# Altium schematic sheet clock.SchDoc: Clock
size 431 x 241 mm; CheckedBy: J. Brinton; CompanyName: Signal Laboratories, Inc.; DrawnBy: J. Brinton; Engineer: J. Brinton; Address1: 3479 Edison Way; Address2: Menlo Park CA 94025; Address3: +1 (877) 778-8435; Address4: siglabs.com; Revision: 3; SheetNumber: 32; SheetTotal: 49
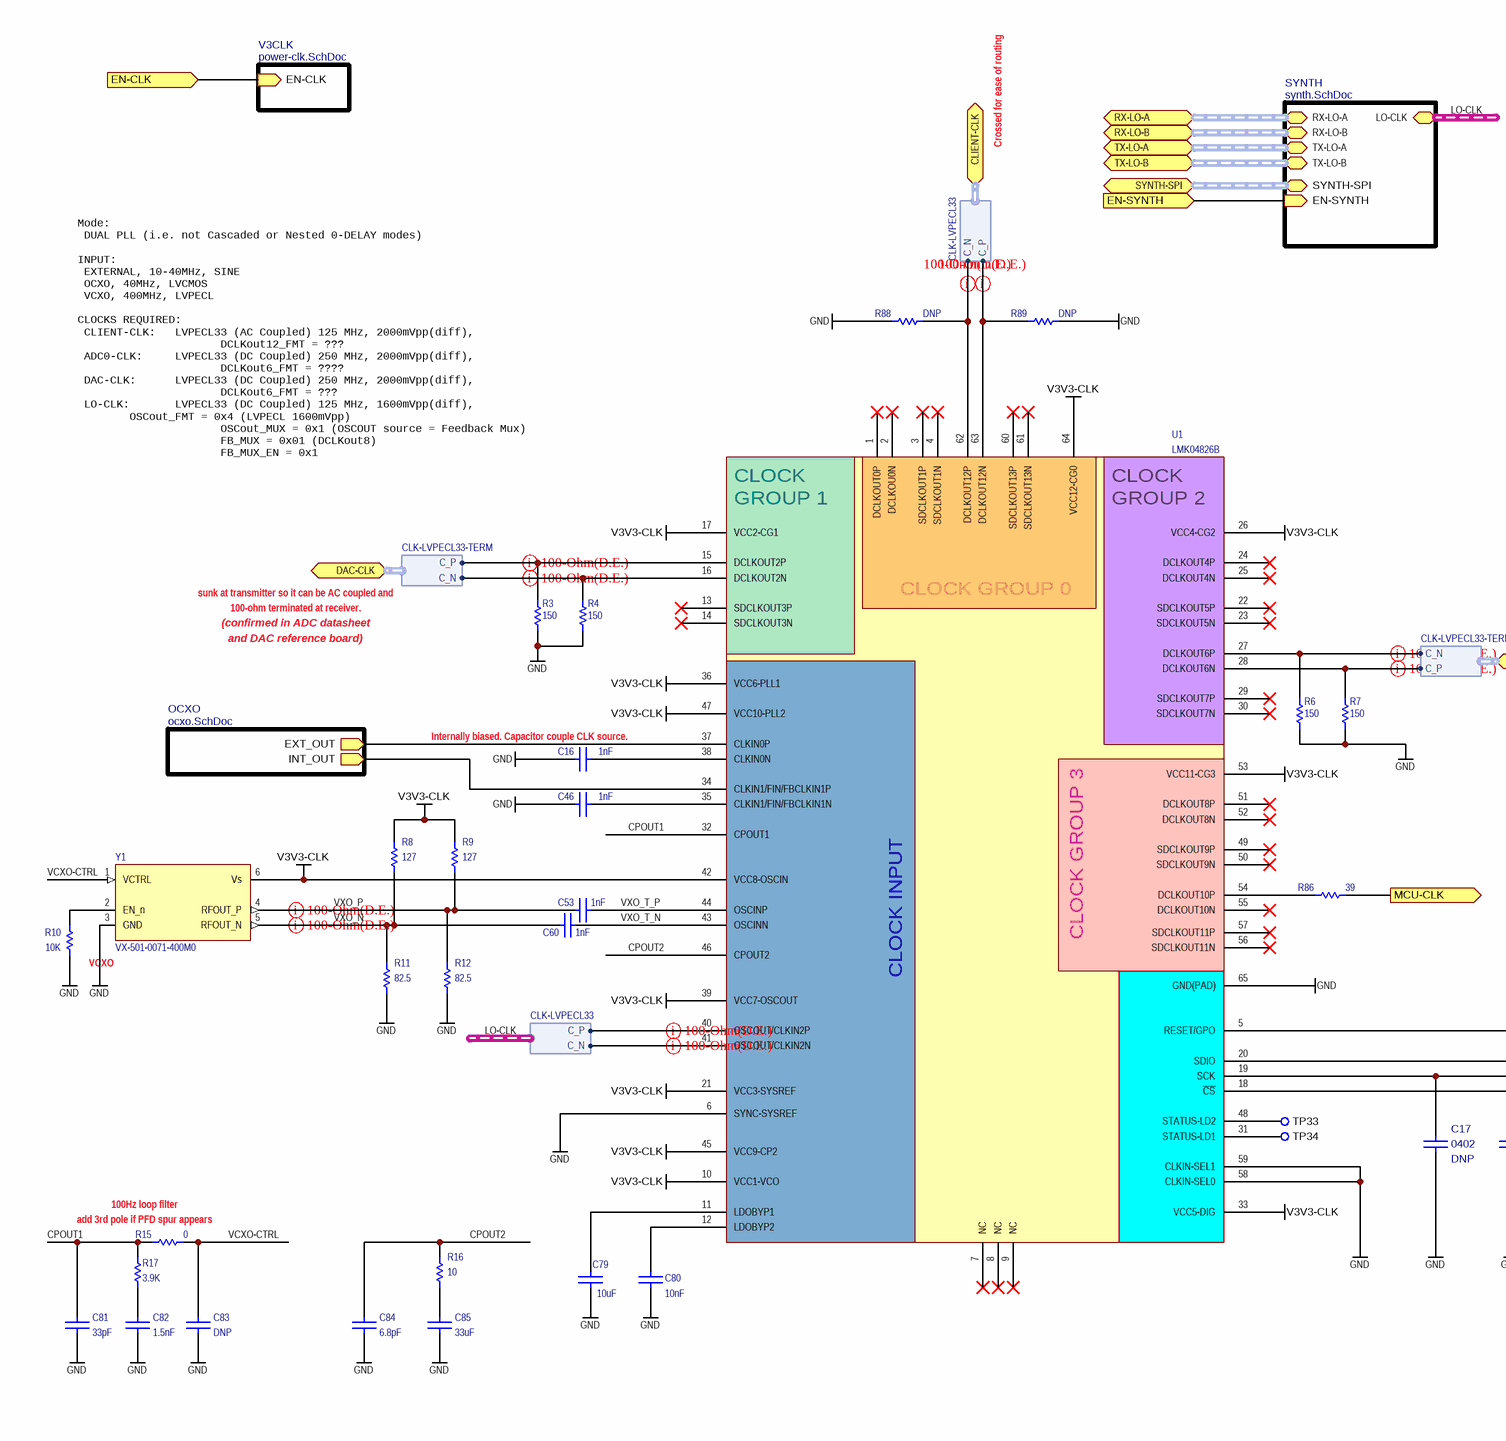
[diagram p0: clock.SchDoc, left]
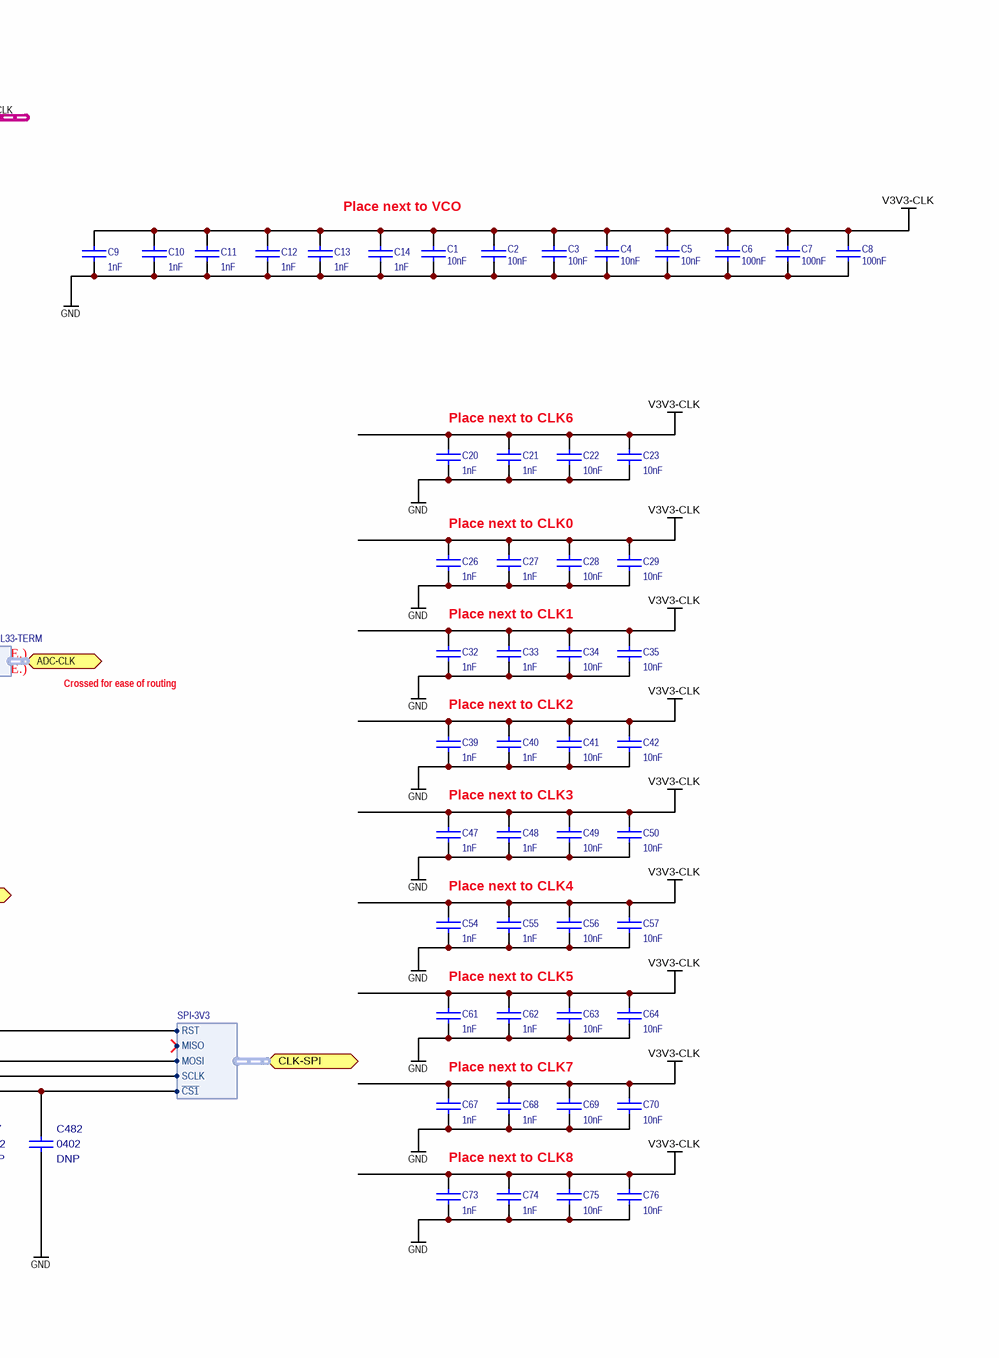
[diagram p1: clock.SchDoc, right]

## Parts
C1  value 10nF  [CAPC100X50X55L25N]  (hidden comment: GRM155R71H103KA88)
C2  value 10nF  [CAPC100X50X55L25N]  (hidden comment: GRM155R71H103KA88)
C3  value 10nF  [CAPC100X50X55L25N]  (hidden comment: GRM155R71H103KA88)
C4  value 10nF  [CAPC100X50X55L25N]  (hidden comment: GRM155R71H103KA88)
C5  value 10nF  [CAPC100X50X55L25N]  (hidden comment: GRM155R71H103KA88)
C6  value 100nF  [CAPC100X50X55L25N]  (hidden comment: GRM155R71C104KA88J)
C7  value 100nF  [CAPC100X50X55L25N]  (hidden comment: GRM155R71C104KA88J)
C8  value 100nF  [CAPC100X50X55L25N]  (hidden comment: GRM155R71C104KA88J)
C9  value 1nF  [CAPC100X50X55L25N]  (hidden comment: CGA2B2NP01H102J050BA)
C10  value 1nF  [CAPC100X50X55L25N]  (hidden comment: CGA2B2NP01H102J050BA)
C11  value 1nF  [CAPC100X50X55L25N]  (hidden comment: CGA2B2NP01H102J050BA)
C12  value 1nF  [CAPC100X50X55L25N]  (hidden comment: CGA2B2NP01H102J050BA)
C13  value 1nF  [CAPC100X50X55L25N]  (hidden comment: CGA2B2NP01H102J050BA)
C14  value 1nF  [CAPC100X50X55L25N]  (hidden comment: CGA2B2NP01H102J050BA)
C16  value 1nF  [CAPC100X50X55L25N]  (hidden comment: CGA2B2NP01H102J050BA)
C17  Package: 0402  Do Not Place: DNP  [CAPC100X50X55L25N]  (hidden comment: VJ0402A101KXA)
C20  value 1nF  [CAPC100X50X55L25N]  (hidden comment: CGA2B2NP01H102J050BA)
C21  value 1nF  [CAPC100X50X55L25N]  (hidden comment: CGA2B2NP01H102J050BA)
C22  value 10nF  [CAPC100X50X55L25N]  (hidden comment: GRM155R71H103KA88)
C23  value 10nF  [CAPC100X50X55L25N]  (hidden comment: GRM155R71H103KA88)
C26  value 1nF  [CAPC100X50X55L25N]  (hidden comment: CGA2B2NP01H102J050BA)
C27  value 1nF  [CAPC100X50X55L25N]  (hidden comment: CGA2B2NP01H102J050BA)
C28  value 10nF  [CAPC100X50X55L25N]  (hidden comment: GRM155R71H103KA88)
C29  value 10nF  [CAPC100X50X55L25N]  (hidden comment: GRM155R71H103KA88)
C32  value 1nF  [CAPC100X50X55L25N]  (hidden comment: CGA2B2NP01H102J050BA)
C33  value 1nF  [CAPC100X50X55L25N]  (hidden comment: CGA2B2NP01H102J050BA)
C34  value 10nF  [CAPC100X50X55L25N]  (hidden comment: GRM155R71H103KA88)
C35  value 10nF  [CAPC100X50X55L25N]  (hidden comment: GRM155R71H103KA88)
C39  value 1nF  [CAPC100X50X55L25N]  (hidden comment: CGA2B2NP01H102J050BA)
C40  value 1nF  [CAPC100X50X55L25N]  (hidden comment: CGA2B2NP01H102J050BA)
C41  value 10nF  [CAPC100X50X55L25N]  (hidden comment: GRM155R71H103KA88)
C42  value 10nF  [CAPC100X50X55L25N]  (hidden comment: GRM155R71H103KA88)
C46  value 1nF  [CAPC100X50X55L25N]  (hidden comment: CGA2B2NP01H102J050BA)
C47  value 1nF  [CAPC100X50X55L25N]  (hidden comment: CGA2B2NP01H102J050BA)
C48  value 1nF  [CAPC100X50X55L25N]  (hidden comment: CGA2B2NP01H102J050BA)
C49  value 10nF  [CAPC100X50X55L25N]  (hidden comment: GRM155R71H103KA88)
C50  value 10nF  [CAPC100X50X55L25N]  (hidden comment: GRM155R71H103KA88)
C53  value 1nF  [CAPC100X50X55L25N]  (hidden comment: CGA2B2NP01H102J050BA)
C54  value 1nF  [CAPC100X50X55L25N]  (hidden comment: CGA2B2NP01H102J050BA)
C55  value 1nF  [CAPC100X50X55L25N]  (hidden comment: CGA2B2NP01H102J050BA)
C56  value 10nF  [CAPC100X50X55L25N]  (hidden comment: GRM155R71H103KA88)
C57  value 10nF  [CAPC100X50X55L25N]  (hidden comment: GRM155R71H103KA88)
C60  value 1nF  [CAPC100X50X55L25N]  (hidden comment: CGA2B2NP01H102J050BA)
C61  value 1nF  [CAPC100X50X55L25N]  (hidden comment: CGA2B2NP01H102J050BA)
C62  value 1nF  [CAPC100X50X55L25N]  (hidden comment: CGA2B2NP01H102J050BA)
C63  value 10nF  [CAPC100X50X55L25N]  (hidden comment: GRM155R71H103KA88)
C64  value 10nF  [CAPC100X50X55L25N]  (hidden comment: GRM155R71H103KA88)
C67  value 1nF  [CAPC100X50X55L25N]  (hidden comment: CGA2B2NP01H102J050BA)
C68  value 1nF  [CAPC100X50X55L25N]  (hidden comment: CGA2B2NP01H102J050BA)
C69  value 10nF  [CAPC100X50X55L25N]  (hidden comment: GRM155R71H103KA88)
C70  value 10nF  [CAPC100X50X55L25N]  (hidden comment: GRM155R71H103KA88)
C73  value 1nF  [CAPC100X50X55L25N]  (hidden comment: CGA2B2NP01H102J050BA)
C74  value 1nF  [CAPC100X50X55L25N]  (hidden comment: CGA2B2NP01H102J050BA)
C75  value 10nF  [CAPC100X50X55L25N]  (hidden comment: GRM155R71H103KA88)
C76  value 10nF  [CAPC100X50X55L25N]  (hidden comment: GRM155R71H103KA88)
C79  value 10uF  [CAPC160X80X90L20N]  (hidden comment: ZRB18AR61E106ME01L)
C80  value 10nF  [CAPC100X50X55L25N]  (hidden comment: GRM155R71H103KA88)
C81  value 33pF  [CAPC100X50X55L25N]  (hidden comment: GRM1555C1H330JA01D)
C82  value 1.5nF  [CAPC100X50X55L25N]  (hidden comment: EMK105SD152KV-F)
C83  Do Not Place: DNP  [CAPC100X50X55L25N]  (hidden comment: CGA2B2NP01H102J050BA)
C84  value 6.8pF  [CAPC160X80X90L20N]  (hidden comment: 06032U6R8BAT2A)
C85  value 33uF  [CAPC2012X145N]  (hidden comment: C2012X5R1A336M125AC)
C482  Package: 0402  Do Not Place: DNP  [CAPC100X50X55L25N]  (hidden comment: VJ0402A101KXA)
R3  value 150  [RESC1005X40N]  (hidden comment: ERJ-2RKF1500X)
R4  value 150  [RESC1005X40N]  (hidden comment: ERJ-2RKF1500X)
R6  value 150  [RESC1005X40N]  (hidden comment: ERJ-2RKF1500X)
R7  value 150  [RESC1005X40N]  (hidden comment: ERJ-2RKF1500X)
R8  value 127  [RESC1005X40N]  (hidden comment: ERA-2AEB1270X)
R9  value 127  [RESC1005X40N]  (hidden comment: ERA-2AEB1270X)
R10  value 10K  [RESC1005X40N]  (hidden comment: ERJ-2RKF1002X)
R11  value 82.5  [RESC1005X40N]  (hidden comment: ERA-2AEB82R5X)
R12  value 82.5  [RESC1005X40N]  (hidden comment: ERA-2AEB82R5X)
R15  value 0  [RESC1005X40N]  (hidden comment: ERJ-2GE0R00X)
R16  value 10  [RESC1005X40N]  (hidden comment: MCS04020C1009FE000)
R17  value 3.9K  [RESC1608X55N]  (hidden comment: ERA-3AEB392V)
R86  value 39  [RESC1005X40N]  (hidden comment: RC0402FR-0739RL)
R88  Do Not Place: DNP  [RESC1005X40N]  (hidden comment: ERJ-2RKF1500X)
R89  Do Not Place: DNP  [RESC1005X40N]  (hidden comment: ERJ-2RKF1500X)
TP33  TEST_POINT_SMD_50  [TEST_POINT_SMD_10]  (value not drawn)  (no BOM)
TP34  TEST_POINT_SMD_50  [TEST_POINT_SMD_10]  (value not drawn)  (no BOM)
U1  LMK04826B  [NKD0064A]
Y1  VX-501-0071-400M0  [G218]

## Sub-sheets
OCXO = ocxo.SchDoc: EXT_OUT (out), INT_OUT (out)
SYNTH = synth.SchDoc: LO-CLK (harness CLK-LVPECL33), RX-LO-A (harness CLK-LVPECL33-TERM), RX-LO-B (harness CLK-LVPECL33-TERM), SYNTH-SPI (harness SPI-3V3), TX-LO-A (harness CLK-LVDS), TX-LO-B (harness CLK-LVDS), EN-SYNTH (in)
V3CLK = power-clk.SchDoc: EN-CLK (in)

## Ports
ADC-CLK (harness CLK-LVPECL33-TERM), CLIENT-CLK (harness CLK-LVPECL33), CLK-SPI (harness SPI-3V3), DAC-CLK (harness CLK-LVPECL33-TERM), EN-CLK (in), EN-SYNTH (in), MCU-CLK (out), RX-LO-A (harness CLK-LVPECL33-TERM), RX-LO-B (harness CLK-LVPECL33-TERM), SYNTH-SPI (harness SPI-3V3), TX-LO-A (harness CLK-LVDS), TX-LO-B (harness CLK-LVDS)

## Harnesses
CLK-LVPECL33: C_P, C_N
CLK-LVPECL33-TERM: C_P, C_N
SPI-3V3: MOSI, MISO, SCLK, ~{CS1}, RST

## Nets
GND: C1.1 C2.1 C3.1 C4.1 C5.1 C6.1 C7.1 C8.1 C9.1 C10.1 C11.1 C12.1 C13.1 C14.1 C16.2 C17.2 C20.1 C21.1 C22.1 C23.1 C26.1 C27.1 C28.1 C29.1 C32.1 C33.1 C34.1 C35.1 C39.1 C40.1 C41.1 C42.1 C46.2 C47.1 C48.1 C49.1 C50.1 C54.1 C55.1 C56.1 C57.1 C61.1 C62.1 C63.1 C64.1 C67.1 C68.1 C69.1 C70.1 C73.1 C74.1 C75.1 C76.1 C79.1 C80.1 C81.2 C82.2 C83.2 C84.2 C85.2 C482.2 R3.2 R4.2 R6.1 R7.1 R10.2 R11.1 R12.1 R88.2 R89.1 U1.6(SYNC-SYSREF) U1.58(CLKIN-SEL0) U1.59(CLKIN-SEL1) U1.65(GND(PAD)) Y1.3(GND)
V3V3-CLK: C1.2 C2.2 C3.2 C4.2 C5.2 C6.2 C7.2 C8.2 C9.2 C10.2 C11.2 C12.2 C13.2 C14.2 C20.2 C21.2 C22.2 C23.2 C26.2 C27.2 C28.2 C29.2 C32.2 C33.2 C34.2 C35.2 C39.2 C40.2 C41.2 C42.2 C47.2 C48.2 C49.2 C50.2 C54.2 C55.2 C56.2 C57.2 C61.2 C62.2 C63.2 C64.2 C67.2 C68.2 C69.2 C70.2 C73.2 C74.2 C75.2 C76.2 R8.2 R9.2 U1.10(VCC1-VCO) U1.17(VCC2-CG1) U1.21(VCC3-SYSREF) U1.26(VCC4-CG2) U1.33(VCC5-DIG) U1.36(VCC6-PLL1) U1.39(VCC7-OSCOUT) U1.42(VCC8-OSCIN) U1.45(VCC9-CP2) U1.47(VCC10-PLL2) U1.53(VCC11-CG3) U1.64(VCC12-CG0) Y1.6(Vs)
CPOUT1: C81.1 R15.1 R17.2 U1.32(CPOUT1)
CPOUT2: C84.1 R16.2 U1.46(CPOUT2)
EN-CLK: port EN-CLK, sheet V3CLK/EN-CLK
EN-SYNTH: port EN-SYNTH, sheet SYNTH/EN-SYNTH
LO-CLK.C_N: U1.41(OSCOUT/CLKIN2N) ; sheet SYNTH/LO-CLK.C_N
LO-CLK.C_P: U1.40(OSCOUT/CLKIN2P) ; sheet SYNTH/LO-CLK.C_P
MCU-CLK: R86.2 ; port MCU-CLK
VCXO-CTRL: C83.1 R15.2 Y1.1(VCTRL)
VXO_N: C60.1 R8.1 R11.2 Y1.5(RFOUT_N)
VXO_P: C53.2 R9.1 R12.2 Y1.4(RFOUT_P)
VXO_T_N: C60.2 U1.43(OSCINN)
VXO_T_P: C53.1 U1.44(OSCINP)
NetC16_1: C16.1 U1.38(CLKIN0N)
NetC17_1: C17.1 U1.19(SCK) ; port CLK-SPI.SCLK
NetC46_1: C46.1 U1.35(CLKIN1/FIN/FBCLKIN1N)
NetC79_2: C79.2 U1.11(LDOBYP1)
NetC80_2: C80.2 U1.12(LDOBYP2)
NetC82_1: C82.1 R17.1
NetC85_1: C85.1 R16.1
NetC482_1: C482.1 U1.18(~{CS}) ; port CLK-SPI.~{CS1}
NetR3_1: R3.1 U1.15(DCLKOUT2P) ; port DAC-CLK.C_P
NetR4_1: R4.1 U1.16(DCLKOUT2N) ; port DAC-CLK.C_N
NetR6_2: R6.2 U1.27(DCLKOUT6P) ; port ADC-CLK.C_N
NetR7_2: R7.2 U1.28(DCLKOUT6N) ; port ADC-CLK.C_P
NetR10_1: R10.1 Y1.2(EN_n)
NetR86_1: R86.1 U1.54(DCLKOUT10P)
NetR88_1: R88.1 U1.62(DCLKOUT12P) ; port CLIENT-CLK.C_N
NetR89_2: R89.2 U1.63(DCLKOUT12N) ; port CLIENT-CLK.C_P
NetTP33_1: TP33.1 U1.48(STATUS-LD2)
NetTP34_1: TP34.1 U1.31(STATUS-LD1)
NetU1_5: U1.5(RESET/GPO) ; port CLK-SPI.RST
NetU1_20: U1.20(SDIO) ; port CLK-SPI.MOSI
NetU1_34: U1.34(CLKIN1/FIN/FBCLKIN1P) ; sheet OCXO/INT_OUT
NetU1_37: U1.37(CLKIN0P) ; sheet OCXO/EXT_OUT

Not connected (* = marked no-connect by the designer): U1 1(DCLKOUT0P)* 2(DCLKOU0N)* 3(SDCLKOUT1P)* 4(SDCLKOUT1N)* 7(NC)* 8(NC)* 9(NC)* 13(SDCLKOUT3P)* 14(SDCLKOUT3N)* 22(SDCLKOUT5P)* 23(SDCLKOUT5N)* 24(DCLKOUT4P)* 25(DCLKOUT4N)* 29(SDCLKOUT7P)* 30(SDCLKOUT7N)* 49(SDCLKOUT9P)* 50(SDCLKOUT9N)* 51(DCLKOUT8P)* 52(DCLKOUT8N)* 55(DCLKOUT10N)* 56(SDCLKOUT11N)* 57(SDCLKOUT11P)* 60(SDCLKOUT13P)* 61(SDCLKOUT13N)*

## Buses and harness runs
harness LO-CLK = sheet SYNTH/LO-CLK
harness port RX-LO-A = sheet SYNTH/RX-LO-A
harness port RX-LO-B = sheet SYNTH/RX-LO-B
harness port SYNTH-SPI = sheet SYNTH/SYNTH-SPI
harness port TX-LO-A = sheet SYNTH/TX-LO-A
harness port TX-LO-B = sheet SYNTH/TX-LO-B

## Layout directives
differential pair; net class z100diff12; Name: 100-Ohm(D.E.): LO-CLK.C_N, LO-CLK.C_P, NetR3_1, NetR4_1, NetR6_2, NetR7_2, NetR88_1, NetR89_2, VXO_N, VXO_P

## Notes on the sheet
- (near R89) Crossed for ease of routing
- Place next to VCO
- Place next to CLK6
- Mode:
  DUAL PLL (i.e. not Cascaded or Nested 0-DELAY modes)
  INPUT:
  EXTERNAL, 10-40MHz, SINE
  OCXO, 40MHz, LVCMOS
  VCXO, 400MHz, LVPECL
  CLOCKS REQUIRED:
  CLIENT-CLK:   LVPECL33 (AC Coupled) 125 MHz, 2000mVpp(diff),
  DCLKout12_FMT = ???
  ADC0-CLK:     LVPECL33 (DC Coupled) 250 MHz, 2000mVpp(diff),
  DCLKout6_FMT = ????
  DAC-CLK:      LVPECL33 (DC Coupled) 250 MHz, 2000mVpp(diff),
  DCLKout6_FMT = ???
  LO-CLK:       LVPECL33 (DC Coupled) 125 MHz, 1600mVpp(diff),
  OSCout_FMT = 0x4 (LVPECL 1600mVpp)
  OSCout_MUX = 0x1 (OSCOUT source = Feedback Mux)
  FB_MUX = 0x01 (DCLKout8)
  FB_MUX_EN = 0x1
- Place next to CLK0
- sunk at transmitter so it can be AC coupled and
- 100-ohm terminated at receiver.
- Place next to CLK1
- (confirmed in ADC datasheet
- and DAC reference board)
- (near R7) Crossed for ease of routing
- (near C16) Internally biased. Capacitor couple CLK source.
- Place next to CLK2
- Place next to CLK3
- Place next to CLK4
- VCXO
- Place next to CLK5
- Place next to CLK7
- 100Hz loop filter
- (near R15) add 3rd pole if PFD spur appears
- Place next to CLK8
- Title
- Engineer
- Revision
- Drawn By
- Checked By
- Date
- Sheet
- of
- (in symbol LMK04828) CLOCK; GROUP 1; GROUP 2; CLOCK GROUP 0; CLOCK GROUP 3; CLOCK INPUT

## Library data of the parts
C1-C5 C22 C23 C28 C29 C34 C35 C41 C42 C49 C50 C56 C57 C63 C64 C69 C70 C75 C76 C80 = CAP 0402: Ceramic Capacitor 10nF ±10% 50V X7R 0402; Manufacturer: Murata; Tr: -55:125; Voltage: 50V; Manufacturer P/N: GRM155R71H103KA88; Package: 0402; Tolerance: ±10%
C6-C8 = CAP 0402: Ceramic Capacitor 100nF ±10% 16V X7R 0402; Manufacturer: Murata; Tr: -55:125; Voltage: 16V; Manufacturer P/N: GRM155R71C104KA88J; Package: 0402; Tolerance: ±10%
C9-C14 C16 C20 C21 C26 C27 C32 C33 C39 C40 C46-C48 C53-C55 C60-C62 C67 C68 C73 C74 C83 = CAP 0402: Ceramic Capacitor 1nF ±5% 50V NP0 0402; Manufacturer: TDK; Tr: -55:150; Voltage: 50V; Manufacturer P/N: CGA2B2NP01H102J050BA; Package: 0402; Tolerance: ±5%
  C83: Value: 1nF
C17 C482 = VJ0402A101JXA: Ceramic Capacitor 100pF ±10% 50V C0G 0402; Manufacturer: Vishay; Tr: -55:150; Manufacturer P/N: VJ0402A101KXA; Tolerance: ±10%; Value: 100pF; Voltage: 50V
C79 = CAP: Ceramic Capacitor 10uF ±20% 25V X5R 0603; Manufacturer: Murata; Tr: -55:85; Manufacturer P/N: ZRB18AR61E106ME01L; Tolerance: ±20%; Voltage: 25V; Footprint: *; Package: 0603
C81 = CAP 0402: Ceramic Capacitor 33pF ±5% 50V NP0 0402; Manufacturer: Murata; Tr: -55:125; Voltage: 50V; Manufacturer P/N: GRM1555C1H330JA01D; Package: 0402; Tolerance: ±5%
C82 = CAP 0402: Ceramic Capacitor 1.5nF ±10% 16V RF 0402; Manufacturer: Taiyo Yuden; Tr: -55:125; Voltage: 16V; Manufacturer P/N: EMK105SD152KV-F; Package: 0402; Tolerance: ±10%
C84 = CAP 0402: Ceramic Capacitor 6.8pF ±0.1pF NP0 0603; Manufacturer: AVX; Voltage: 200V; Tr: -55"125; Manufacturer P/N: 06032U6R8BAT2A; Package: 0603; Tolerance: ±0.1pF
C85 = CAP 0402: Ceramic Capacitor 33uF ±20% 10V X5R 0805; Manufacturer: TDK; Tr: -55:85; Voltage: 10V; Manufacturer P/N: C2012X5R1A336M125AC; Package: 0805; Tolerance: ±20%
R3 R4 R6 R7 = RES 0402: Thick Film 150 ±1% 0402; Manufacturer: Panasonic; Tr: -55:155; Package: 0402; Manufacturer P/N: ERJ-2RKF1500X; Do Not Place: *; Tolerance: ±1%
R8 R9 = RES 0402: Thin Film Resistor 127 ±0.1% 0402; Manufacturer: Panasonic; Tr: -55:155; Package: 0402; Manufacturer P/N: ERA-2AEB1270X; Do Not Place: *; Tolerance: ±0.1%
R10 = RES 0402: Thick Film Resistor 10k ±1% 0.1W 50V 0402; Manufacturer: Panasonic; Tr: -55:155; Package: 0402; Manufacturer P/N: ERJ-2RKF1002X; Tolerance: ±1%
R11 R12 = RES 0402: Thin Film Resistor 82.5 ±0.1% 0402; Manufacturer: Panasonic; Tr: -55:155; Package: 0402; Manufacturer P/N: ERA-2AEB82R5X; Do Not Place: *; Tolerance: ±0.1%
R15 = RES 0603: Thick Film Resistor Jumper 0402; Manufacturer: Panasonic; Tr: -55:155; Package: 0402; Manufacturer P/N: ERJ-2GE0R00X
R16 = RES 0402: Thin Film Resistor 10 Ohm ±1% 0402; Manufacturer: Vishay; Tr: -55:155; Package: 0402; Manufacturer P/N: MCS04020C1009FE000; Do Not Place: *; Tolerance: ±1%
R17 = RES 0603: Thin Film Resistor 3.9k ±0.1% 0603; Manufacturer: Panasonic; Tr: -55:155; Package: 0603; Manufacturer P/N: ERA-3AEB392V; Tolerance: ±0.1%
R86 = RES 0402: Thick Film Resistor 39 ±1% 0402; Manufacturer: Yageo; Tr: -55:155; Package: 0402; Manufacturer P/N: RC0402FR-0739RL; Do Not Place: *; Tolerance: ±1%
R88 R89 = RES 0402: Thick Film 150 ±1% 0402; Manufacturer: Panasonic; Value: 150; Tr: -55:155; Package: 0402; Manufacturer P/N: ERJ-2RKF1500X; Tolerance: ±1%
TP33 TP34 = TEST_POINT_SMD_50: Test Point SMD
U1 = LMK04828: Low-Noise Clock Jitter Cleaner with Dual Loop PLLs; Manufacturer: Texas Instruments; Manufacturer P/N: LMK04826B
Y1 = VX-501: VCXO, Ultra Low Phase Noise, 490MHz; Manufacturer: Vectron; Manufacturer P/N: VX-501-0071-400M0; Do Not Place: *